# Altium schematic sheet FLoRa0.0.SchDoc
size 420 x 297 mm; SheetNumber: 1; SheetTotal: 5; ENG_APP_DATE: --/--/--; DSN_APP_DATE: --/--/--; CHK_APP_DATE: --/--/--; SPICEModelCacheCJHNTGTK: <root> / <DocumentId>CJHNTGTK</DocumentId> / </root>
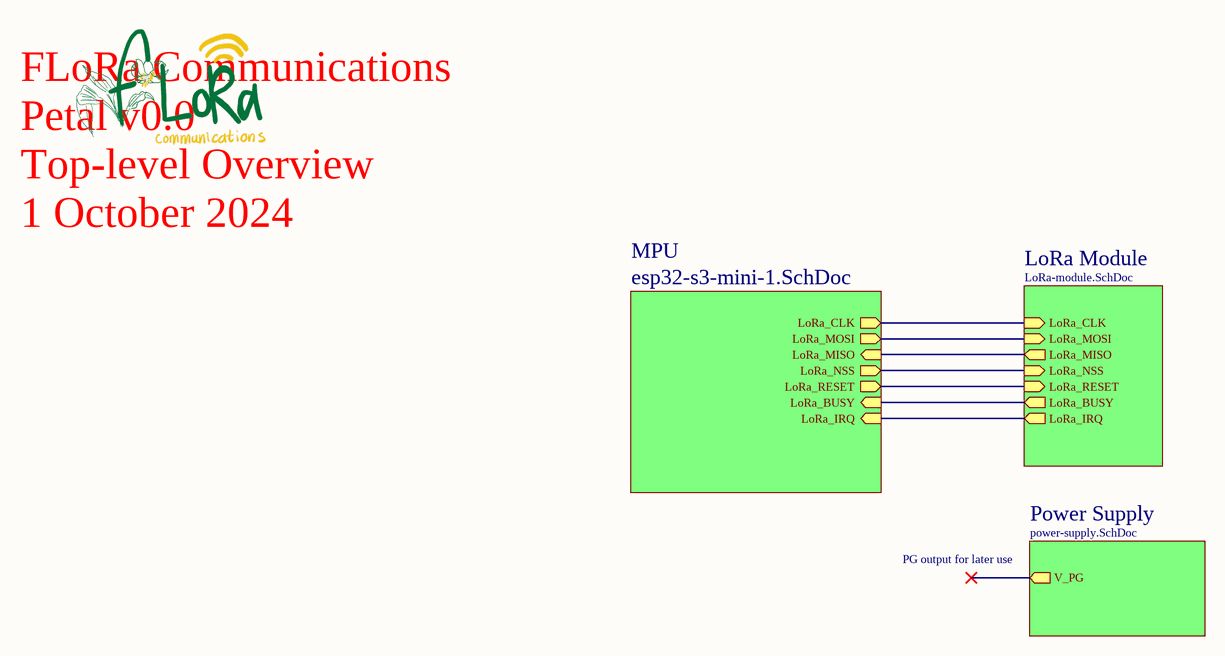
[diagram p0: FLoRa0.0.SchDoc]

## Sub-sheets
LoRa Module = LoRa-module.SchDoc: LoRa_NSS (in), LoRa_RESET (in), LoRa_BUSY (out), LoRa_IRQ (out), LoRa_CLK (in), LoRa_MOSI (in), LoRa_MISO (out)
MPU = esp32-s3-mini-1.SchDoc: LoRa_NSS (out), LoRa_RESET (out), LoRa_IRQ (in), LoRa_BUSY (in), LoRa_CLK (out), LoRa_MOSI (out), LoRa_MISO (in)
Power Supply = power-supply.SchDoc: V_PG (out)

## Nets
(unnamed): sheet MPU/LoRa_NSS, sheet LoRa Module/LoRa_NSS
(unnamed): sheet MPU/LoRa_RESET, sheet LoRa Module/LoRa_RESET
(unnamed): sheet MPU/LoRa_IRQ, sheet LoRa Module/LoRa_IRQ
(unnamed): sheet MPU/LoRa_BUSY, sheet LoRa Module/LoRa_BUSY
(unnamed): sheet MPU/LoRa_CLK, sheet LoRa Module/LoRa_CLK
(unnamed): sheet MPU/LoRa_MOSI, sheet LoRa Module/LoRa_MOSI
(unnamed): sheet MPU/LoRa_MISO, sheet LoRa Module/LoRa_MISO

## Notes on the sheet
- FLoRa Communications
  Petal v0.0
  Top-level Overview
  1 October 2024
- PG output for later use
- THIS DOCUMENT AND THE DATA DISCLOSED HEREIN OR
- HEREWITH IS THE PROPERTY OF ALTIUM LIMITED AND MAY
- DWG NO:
- REVISION
- REV:
- DESCRIPTION
- DATE
- APPROVED
- BE FREELY DISTRIBUTED IN WHOLE. NO RIGHTS ARE
- RESERVED OR EXPRESS OR IMPLIED WARANTEE GIVEN.
- ENG:
- APPROVALS
- PROJECT
- DSN:
- CHK:
- REFERENCE DOCUMENTS
- PROJECT REVISION:
- TITLE
- DOCUMENT REVISION:
- DESIGN ITEM:
- BOM:
- FAB DWG:
- PCB DWG:
- ASSY DWG:
- SCALE:
- A3
- SIZE
- CAGE CODE
- FILE NAME
- DWG NO.
- SHEET
- OF
- REV